# EAGLE schematic xr_vco_pots_V2 (EAGLE 7.3.0)
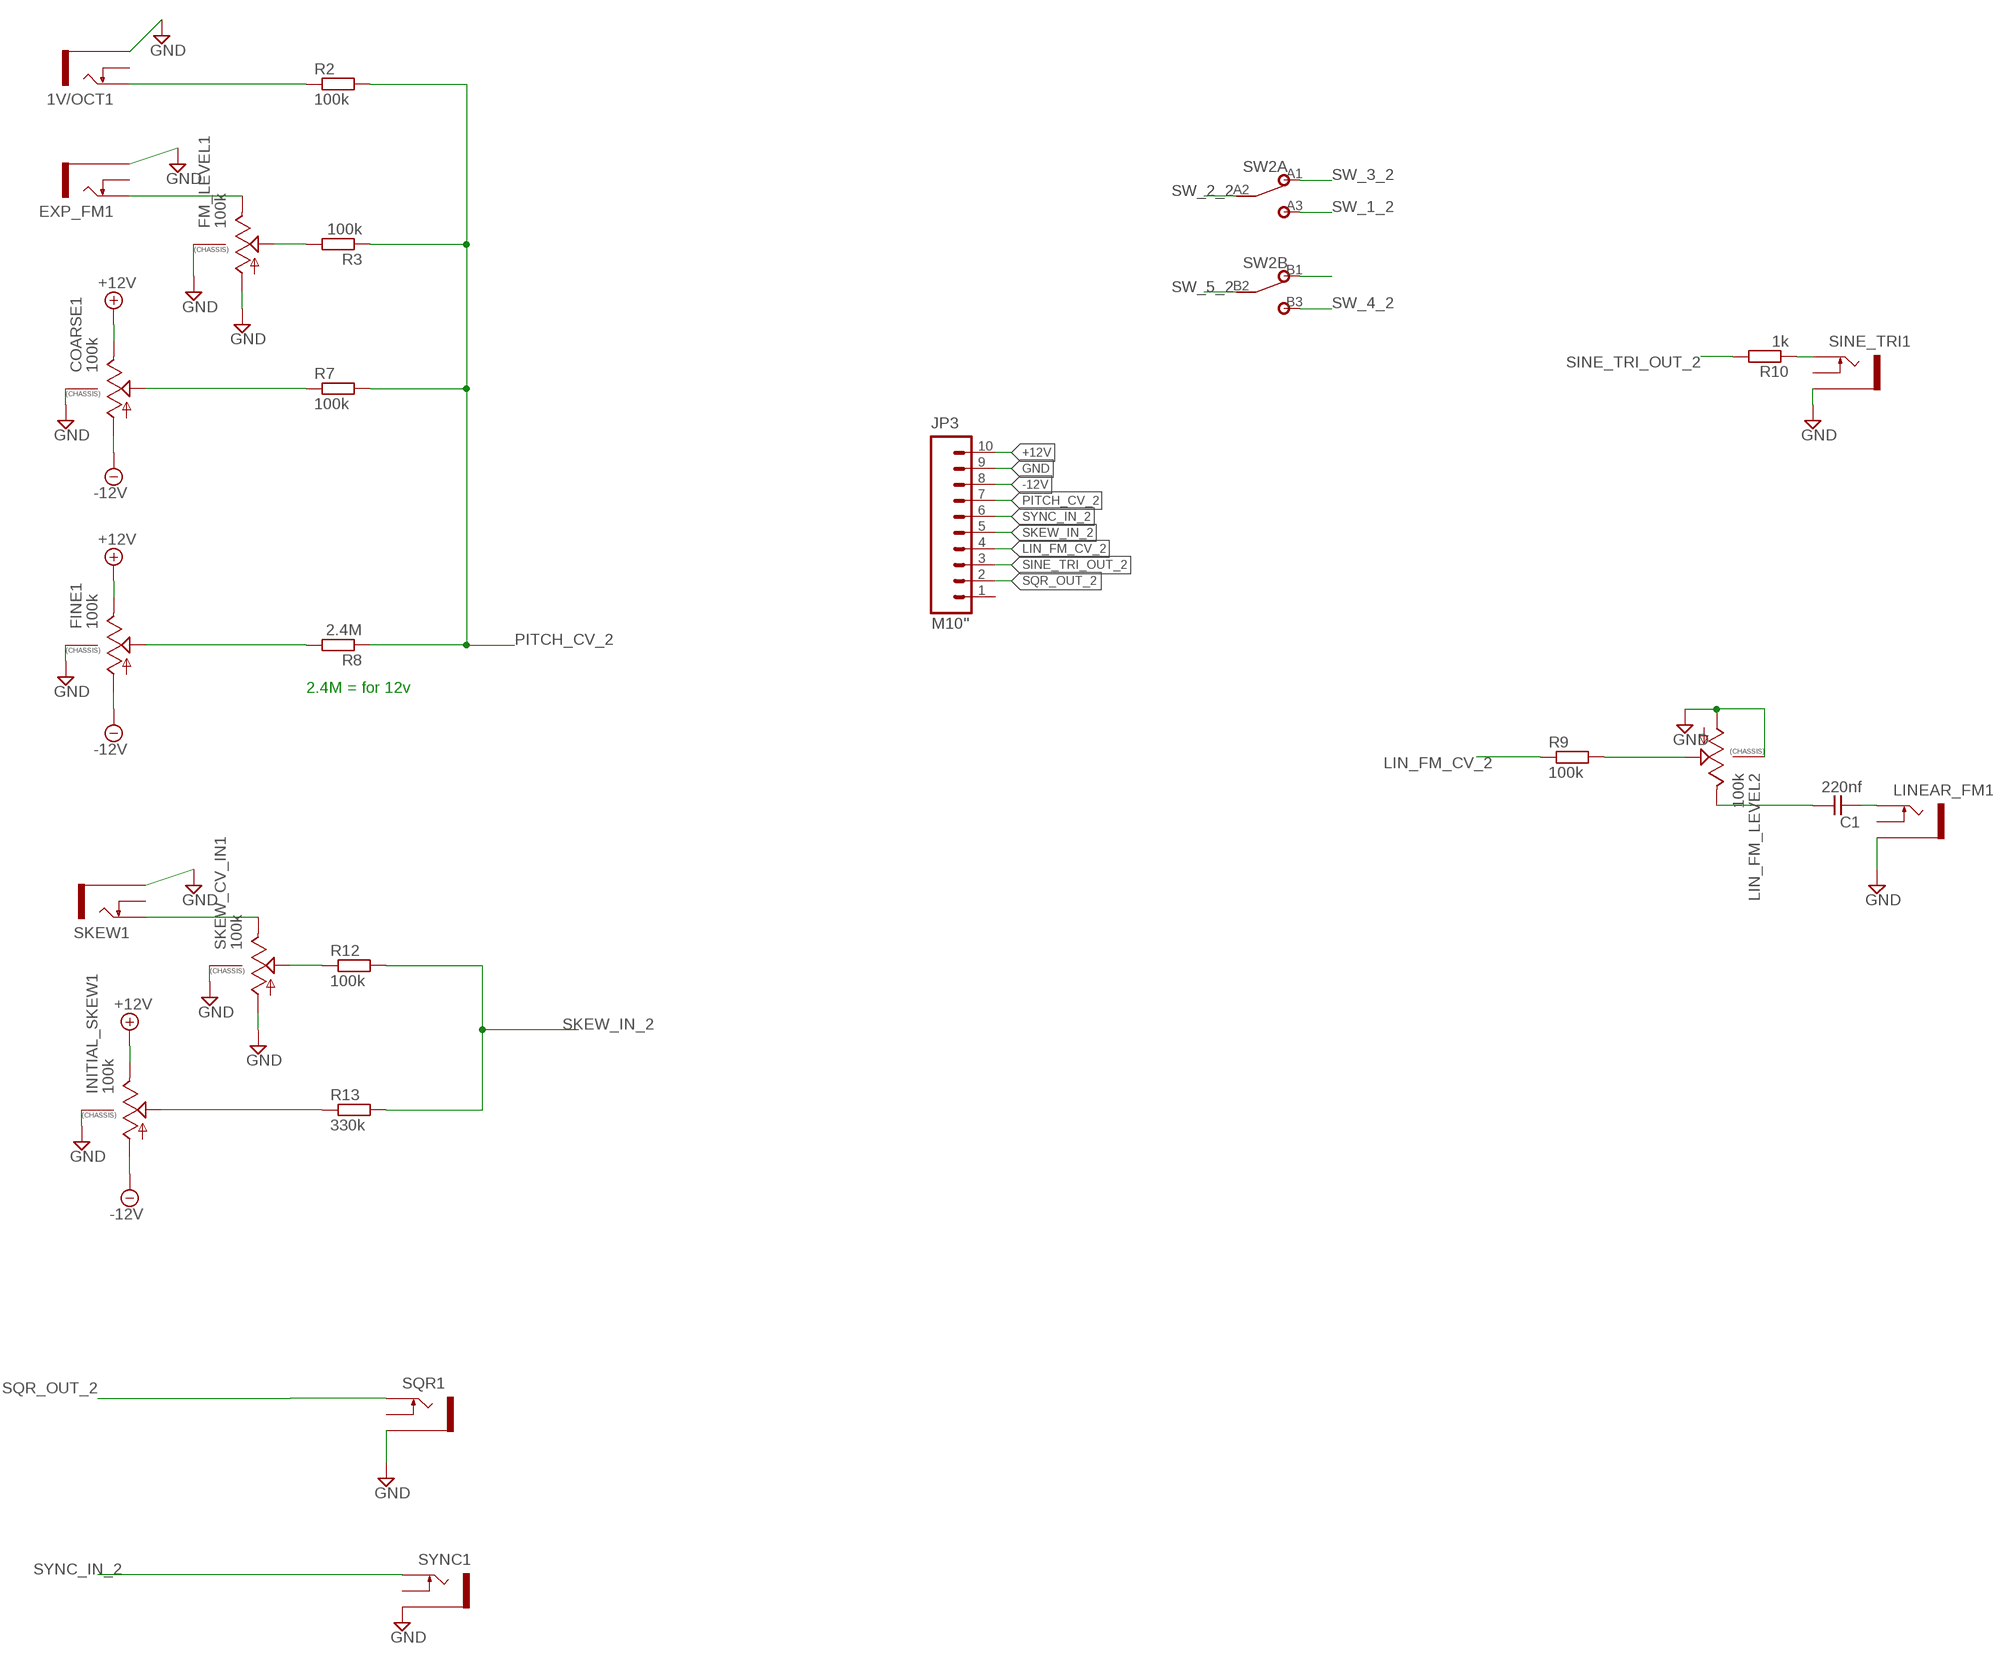
[diagram p0: schematic, sheet 1, part 1 of 2]
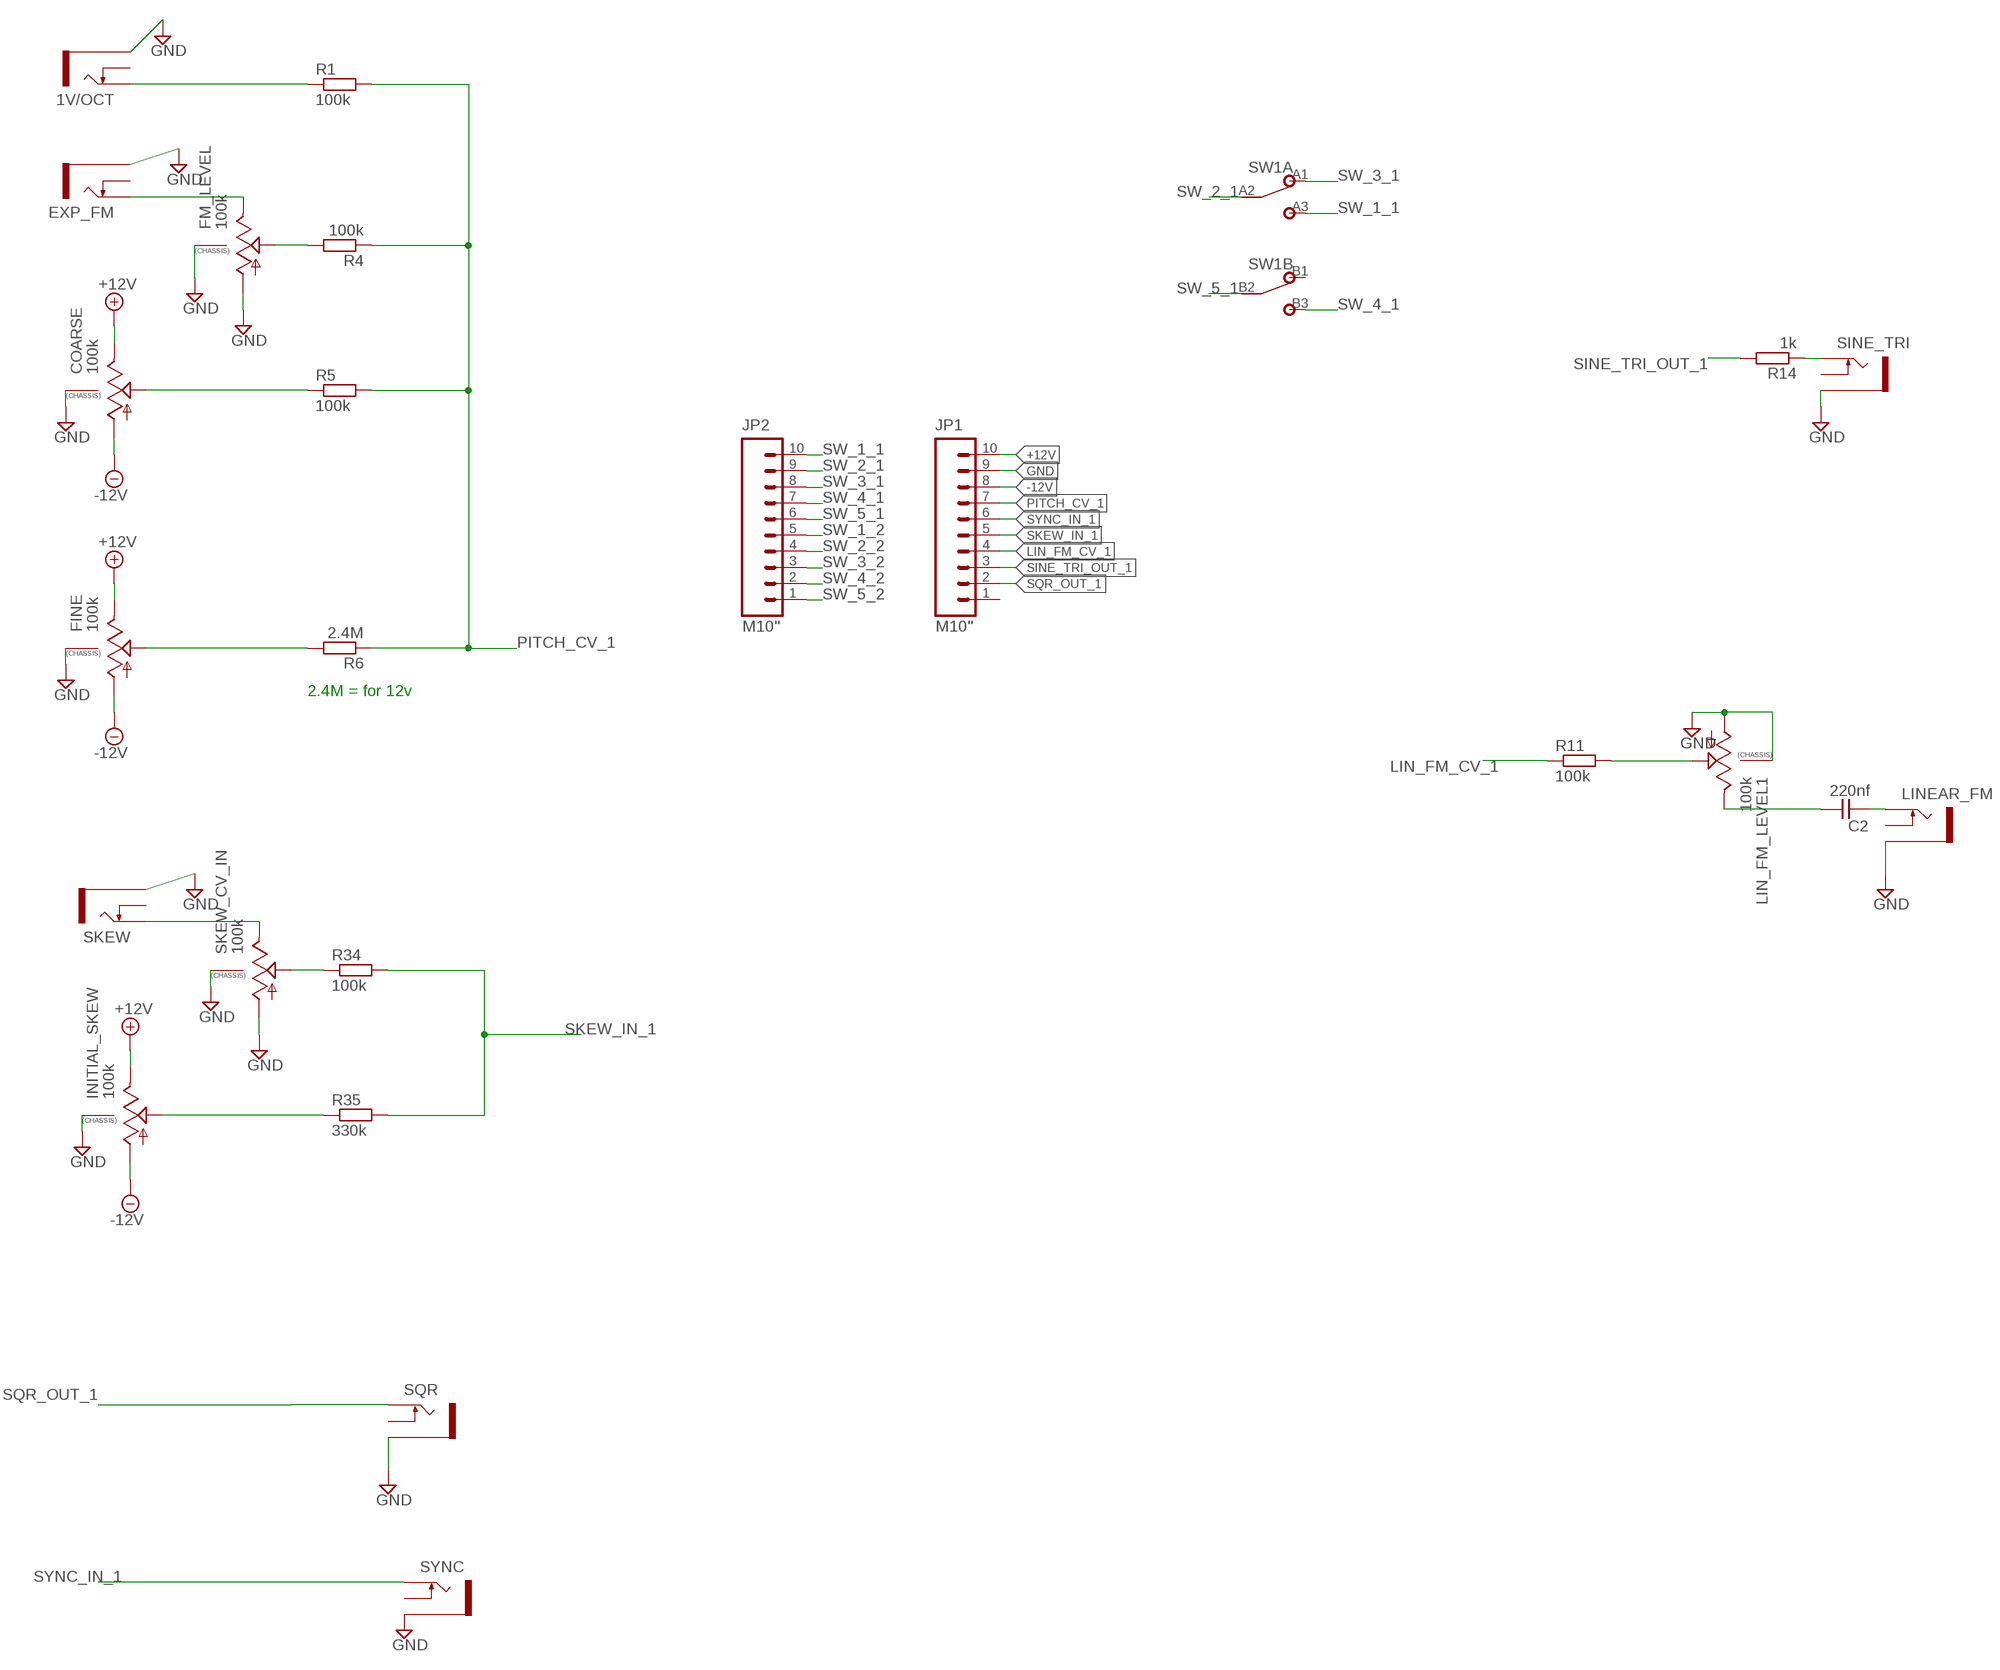
[diagram p1: schematic, sheet 1, part 2 of 2]

## Parts
1V/OCT  THONKICONNNEW  [WQP-PJ301M-12_JACK]
1V/OCT1  THONKICONNNEW  [WQP-PJ301M-12_JACK]
C1  220nf  C-EU050-024X044  [C050-024X044]
C2  220nf  C-EU050-024X044  [C050-024X044]
COARSE  100k  9MM_SNAP-IN_POT_CHASSIS  [9MM_SNAP-IN_POT]
COARSE1  100k  9MM_SNAP-IN_POT_CHASSIS  [9MM_SNAP-IN_POT]
EXP_FM  THONKICONNNEW  [WQP-PJ301M-12_JACK]
EXP_FM1  THONKICONNNEW  [WQP-PJ301M-12_JACK]
FINE  100k  9MM_SNAP-IN_POT_CHASSIS  [9MM_SNAP-IN_POT]
FINE1  100k  9MM_SNAP-IN_POT_CHASSIS  [9MM_SNAP-IN_POT]
FM_LEVEL  100k  9MM_SNAP-IN_POT_CHASSIS  [9MM_SNAP-IN_POT]
FM_LEVEL1  100k  9MM_SNAP-IN_POT_CHASSIS  [9MM_SNAP-IN_POT]
INITIAL_SKEW  100k  9MM_SNAP-IN_POT_CHASSIS  [9MM_SNAP-IN_POT]
INITIAL_SKEW1  100k  9MM_SNAP-IN_POT_CHASSIS  [9MM_SNAP-IN_POT]
JP1  M10"  [1X10]
JP2  M10"  [1X10]
JP3  M10"  [1X10]
LIN_FM_LEVEL1  100k  9MM_SNAP-IN_POT_CHASSIS  [9MM_SNAP-IN_POT]
LIN_FM_LEVEL2  100k  9MM_SNAP-IN_POT_CHASSIS  [9MM_SNAP-IN_POT]
LINEAR_FM  THONKICONNNEW  [WQP-PJ301M-12_JACK]
LINEAR_FM1  THONKICONNNEW  [WQP-PJ301M-12_JACK]
R1  100k  RESISTOR7MM  [7MM_RESISTOR]
R2  100k  RESISTOR7MM  [7MM_RESISTOR]
R3  100k  RESISTOR7MM  [7MM_RESISTOR]
R4  100k  RESISTOR7MM  [7MM_RESISTOR]
R5  100k  RESISTOR7MM  [7MM_RESISTOR]
R6  2.4M  RESISTOR7MM  [7MM_RESISTOR]
R7  100k  RESISTOR7MM  [7MM_RESISTOR]
R8  2.4M  RESISTOR7MM  [7MM_RESISTOR]
R9  100k  RESISTOR7MM  [7MM_RESISTOR]
R10  1k  RESISTOR7MM  [7MM_RESISTOR]
R11  100k  RESISTOR7MM  [7MM_RESISTOR]
R12  100k  RESISTOR7MM  [7MM_RESISTOR]
R13  330k  RESISTOR7MM  [7MM_RESISTOR]
R14  1k  RESISTOR7MM  [7MM_RESISTOR]
R34  100k  RESISTOR7MM  [7MM_RESISTOR]
R35  330k  RESISTOR7MM  [7MM_RESISTOR]
SINE_TRI  THONKICONNNEW  [WQP-PJ301M-12_JACK]
SINE_TRI1  THONKICONNNEW  [WQP-PJ301M-12_JACK]
SKEW  THONKICONNNEW  [WQP-PJ301M-12_JACK]
SKEW1  THONKICONNNEW  [WQP-PJ301M-12_JACK]
SKEW_CV_IN  100k  9MM_SNAP-IN_POT_CHASSIS  [9MM_SNAP-IN_POT]
SKEW_CV_IN1  100k  9MM_SNAP-IN_POT_CHASSIS  [9MM_SNAP-IN_POT]
SQR  THONKICONNNEW  [WQP-PJ301M-12_JACK]
SQR1  THONKICONNNEW  [WQP-PJ301M-12_JACK]
SW1  DPDT  [DPDT]
SW2  DPDT  [DPDT]
SYNC  THONKICONNNEW  [WQP-PJ301M-12_JACK]
SYNC1  THONKICONNNEW  [WQP-PJ301M-12_JACK]

## Nets
+12V: COARSE1.3(E) COARSE.3(E) FINE1.3(E) FINE.3(E) INITIAL_SKEW1.3(E) INITIAL_SKEW.3(E) JP1.10 JP3.10
-12V: COARSE1.1(A) COARSE.1(A) FINE1.1(A) FINE.1(A) INITIAL_SKEW1.1(A) INITIAL_SKEW.1(A) JP1.8 JP3.8
GND: 1V/OCT1.P$3_SLEEVE(SLEEVE) 1V/OCT.P$3_SLEEVE(SLEEVE) COARSE1.CHASSIS2 COARSE.CHASSIS2 EXP_FM1.P$3_SLEEVE(SLEEVE) EXP_FM.P$3_SLEEVE(SLEEVE) FINE1.CHASSIS2 FINE.CHASSIS2 FM_LEVEL1.1(A) FM_LEVEL1.CHASSIS2 FM_LEVEL.1(A) FM_LEVEL.CHASSIS2 INITIAL_SKEW1.CHASSIS2 INITIAL_SKEW.CHASSIS2 JP1.9 JP3.9 LIN_FM_LEVEL1.1(A) LIN_FM_LEVEL1.CHASSIS2 LIN_FM_LEVEL2.1(A) LIN_FM_LEVEL2.CHASSIS2 LINEAR_FM1.P$3_SLEEVE(SLEEVE) LINEAR_FM.P$3_SLEEVE(SLEEVE) SINE_TRI1.P$3_SLEEVE(SLEEVE) SINE_TRI.P$3_SLEEVE(SLEEVE) SKEW1.P$3_SLEEVE(SLEEVE) SKEW.P$3_SLEEVE(SLEEVE) SKEW_CV_IN1.1(A) SKEW_CV_IN1.CHASSIS2 SKEW_CV_IN.1(A) SKEW_CV_IN.CHASSIS2 SQR1.P$3_SLEEVE(SLEEVE) SQR.P$3_SLEEVE(SLEEVE) SYNC1.P$3_SLEEVE(SLEEVE) SYNC.P$3_SLEEVE(SLEEVE)
LIN_FM_CV_1: JP1.4 R11.1
LIN_FM_CV_2: JP3.4 R9.1
N$1: 1V/OCT.P$1_TIP(TIP) R1.1
N$2: EXP_FM.P$1_TIP(TIP) FM_LEVEL.3(E)
N$3: FM_LEVEL.2(S) R4.2
N$4: COARSE.2(S) R5.1
N$5: FINE.2(S) R6.2
N$6: 1V/OCT1.P$1_TIP(TIP) R2.1
N$7: EXP_FM1.P$1_TIP(TIP) FM_LEVEL1.3(E)
N$8: FM_LEVEL1.2(S) R3.2
N$9: COARSE1.2(S) R7.1
N$10: FINE1.2(S) R8.2
N$11: LIN_FM_LEVEL2.2(S) R9.2
N$12: C1.1 LIN_FM_LEVEL2.3(E)
N$13: C1.2 LINEAR_FM1.P$1_TIP(TIP)
N$14: R10.1 SINE_TRI1.P$1_TIP(TIP)
N$15: SKEW1.P$1_TIP(TIP) SKEW_CV_IN1.3(E)
N$16: R12.1 SKEW_CV_IN1.2(S)
N$17: LIN_FM_LEVEL1.2(S) R11.2
N$18: R14.1 SINE_TRI.P$1_TIP(TIP)
N$19: C2.1 LIN_FM_LEVEL1.3(E)
N$20: C2.2 LINEAR_FM.P$1_TIP(TIP)
N$21: INITIAL_SKEW1.2(S) R13.1
N$42: SKEW.P$1_TIP(TIP) SKEW_CV_IN.3(E)
N$43: R34.1 SKEW_CV_IN.2(S)
N$44: INITIAL_SKEW.2(S) R35.1
PITCH_CV_1: JP1.7 R1.2 R4.1 R5.2 R6.1
PITCH_CV_2: JP3.7 R2.2 R3.1 R7.2 R8.1
SINE_TRI_OUT_1: JP1.3 R14.2
SINE_TRI_OUT_2: JP3.3 R10.2
SKEW_IN_1: JP1.5 R34.2 R35.2
SKEW_IN_2: JP3.5 R12.2 R13.2
SQR_OUT_1: JP1.2 SQR.P$1_TIP(TIP)
SQR_OUT_2: JP3.2 SQR1.P$1_TIP(TIP)
SW_1_1: JP2.10 SW1.A3
SW_1_2: JP2.5 SW2.A3
SW_2_1: JP2.9 SW1.A2
SW_2_2: JP2.4 SW2.A2
SW_3_1: JP2.8 SW1.A1
SW_3_2: JP2.3 SW2.A1
SW_4_1: JP2.7 SW1.B3
SW_4_2: JP2.2 SW2.B3
SW_5_1: JP2.6 SW1.B2
SW_5_2: JP2.1 SW2.B2
SW_6: SW2.B1
SYNC_IN_1: JP1.6 SYNC.P$1_TIP(TIP)
SYNC_IN_2: JP3.6 SYNC1.P$1_TIP(TIP)
Unconnected: 1V/OCT1.P$2_SWITCH(SWITCH) 1V/OCT.P$2_SWITCH(SWITCH) EXP_FM1.P$2_SWITCH(SWITCH) EXP_FM.P$2_SWITCH(SWITCH) JP1.1 JP3.1 LINEAR_FM1.P$2_SWITCH(SWITCH) LINEAR_FM.P$2_SWITCH(SWITCH) SINE_TRI1.P$2_SWITCH(SWITCH) SINE_TRI.P$2_SWITCH(SWITCH) SKEW1.P$2_SWITCH(SWITCH) SKEW.P$2_SWITCH(SWITCH) SQR1.P$2_SWITCH(SWITCH) SQR.P$2_SWITCH(SWITCH) SW1.B1 SYNC1.P$2_SWITCH(SWITCH) SYNC.P$2_SWITCH(SWITCH)

## Notes on the sheet
- 2.4M = for 12v
- 2.4M = for 12v

## Library data of the parts
1V/OCT 1V/OCT1 EXP_FM EXP_FM1 LINEAR_FM LINEAR_FM1 SINE_TRI SINE_TRI1 SKEW SKEW1 SQR SQR1 SYNC SYNC1 = MusicThingModular:THONKICONN: 3.5mm socket for Eurorack modular synths
C1 C2 = TomW:C-EU: CAPACITOR, European symbol
COARSE COARSE1 FINE FINE1 FM_LEVEL FM_LEVEL1 INITIAL_SKEW INITIAL_SKEW1 LIN_FM_LEVEL1 LIN_FM_LEVEL2 SKEW_CV_IN SKEW_CV_IN1 = MusicThingModular:9MM_SNAP-IN_POT_CHASSIS: 9mm vertical snap-in pot, Alpha / Panasonic style, with a connection to the metal chassis for grounding
JP1-JP3 = SparkFun-Connectors:M10: Header 10 Standard 10-pin 0.1" header. Use with straight break away headers (SKU : PRT-00116), right angle break away headers (PRT-00553), swiss pins (PRT-00743), machine pins (PRT-00117), and female headers (PRT-00115).
R1-R14 R34 R35 = MusicThingModular:RESISTOR: Standard resistor, various versions
SW1 SW2 = gm-switches:DPDT

## Net classes
1 power: width 0.406 mm
2 ground: width 0.305 mm